# EAGLE design tclab_v_2 (EAGLE 7.2.0)
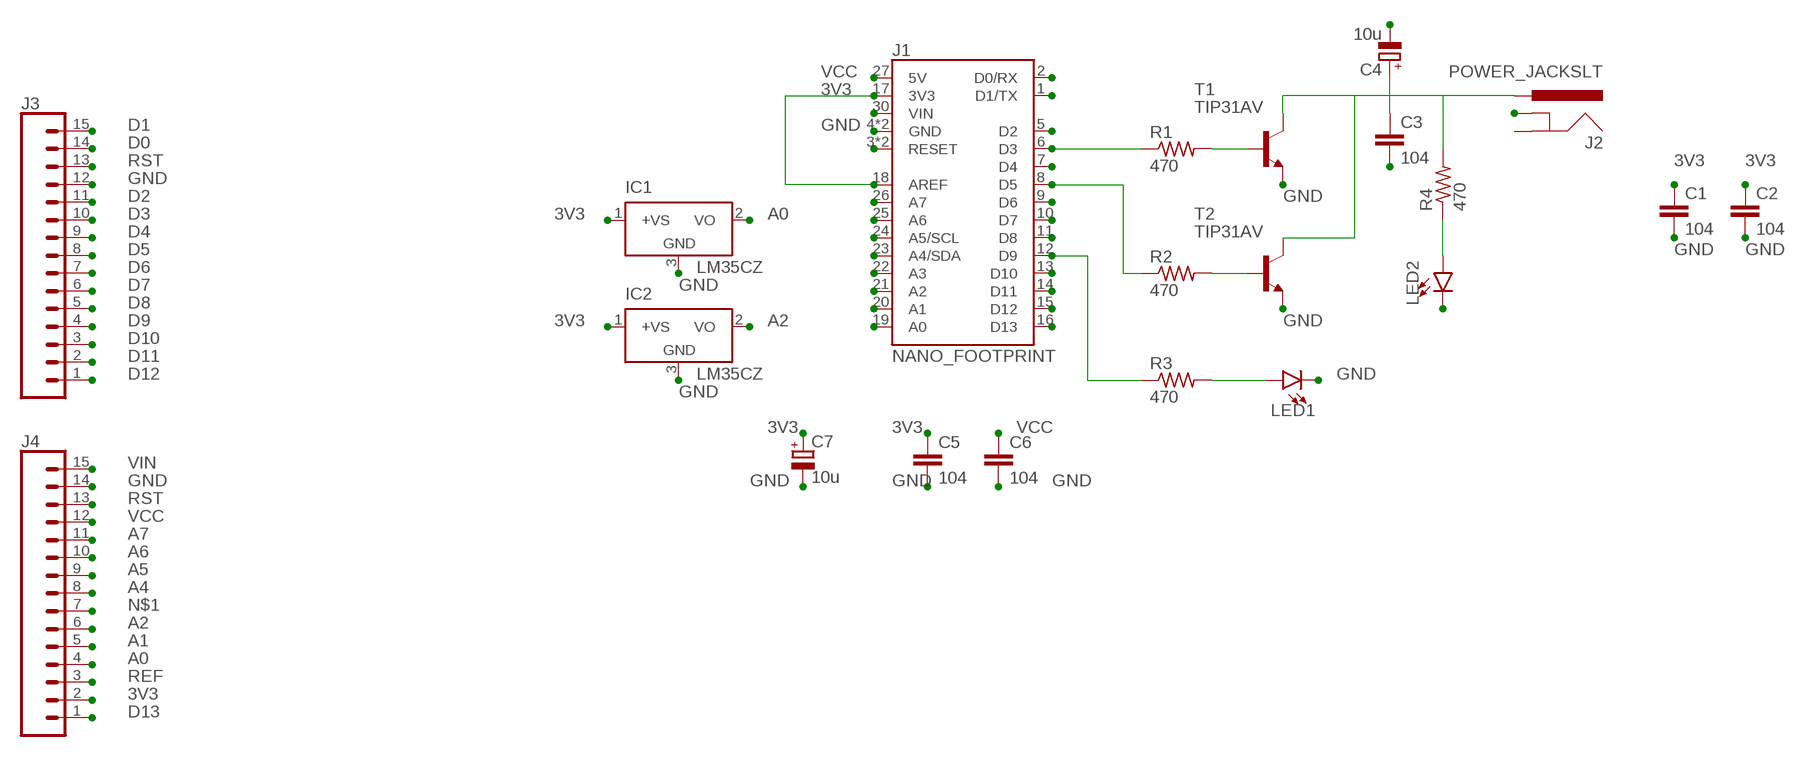
[diagram p0: schematic, sheet 1]

## Parts
C1  104  C-EU025-025X050  [C025-025X050]
C2  104  C-EU025-025X050  [C025-025X050]
C3  104  C-EU025-025X050  [C025-025X050]
C4  10u  CPOL-EUE2.5-7  [E2,5-7]
C5  104  C-EU025-025X050  [C025-025X050]
C6  104  C-EU025-025X050  [C025-025X050]
C7  10u  CPOL-EUE2.5-7  [E2,5-7]
IC1  LM35CZ  [TO92]
IC2  LM35CZ  [TO92]
J1  NANO_FOOTPRINT  [NANO]
J2  POWER_JACKSLT  [POWER_JACK_SLOT]
J3  CONN_15  [1X15]
J4  CONN_15  [1X15]
LED1  LED5MM  [LED_5MM]
LED2  LED5MM  [LED_5MM]
R1  470  R-US_0204/7  [0204/7]
R2  470  R-US_0204/7  [0204/7]
R3  470  R-US_0204/7  [0204/7]
R4  470  R-US_0204/7  [0204/7]
T1  TIP31AV  [TO220AV]
T2  TIP31AV  [TO220AV]

## Nets
3V3: C1.1 C2.1 C5.1 C7.+ IC1.1(+VS) IC2.1(+VS) J1.17(3V3) J1.18(AREF) J4.2
A0: IC1.2(VO) J1.19(A0) J4.4
A1: J1.20(A1) J4.5
A2: IC2.2(VO) J1.21(A2) J4.6
A4: J1.23(A4/SDA) J4.8
A5: J1.24(A5/SCL) J4.9
A6: J1.25(A6) J4.10
A7: J1.26(A7) J4.11
D0: J1.2(D0/RX) J3.14
D1: J1.1(D1/TX) J3.15
D2: J1.5(D2) J3.11
D3: J1.6(D3) J3.10 R1.1
D4: J1.7(D4) J3.9
D5: J1.8(D5) J3.8 R2.1
D6: J1.9(D6) J3.7
D7: J1.10(D7) J3.6
D8: J1.11(D8) J3.5
D9: J1.12(D9) J3.4 R3.1
D10: J1.13(D10) J3.3
D11: J1.14(D11) J3.2
D12: J1.15(D12) J3.1
D13: J1.16(D13) J4.1
GND: C1.2 C2.2 C3.2 C4.- C5.2 C6.2 C7.- IC1.3(GND) IC2.3(GND) J1.4(GND) J1.29(GND) J2.GND@1(GNDBREAK) J3.12 J4.14 LED1.K(C) LED2.K(C) T1.3(E) T2.3(E)
N$1: J1.22(A3) J4.7
N$4: LED1.A R3.2
N$6: R2.2 T2.1(B)
N$8: R1.2 T1.1(B)
N$9: C3.1 C4.+ J2.PWR R4.2 T1.2(C) T2.2(C)
N$10: LED2.A R4.1
REF: J4.3
RST: J1.3(RESET) J1.28(RESET) J3.13 J4.13
VCC: C6.1 J1.27(5V) J4.12
VIN: J1.30(VIN) J4.15
Unconnected: J2.GND@2(GND)

## Library data of the parts
C1-C3 C5 C6 = resistor:C-EU: CAPACITOR, European symbol
C4 C7 = rcl:CPOL-EU: POLARIZED CAPACITOR, European symbol
IC1 IC2 = lm35:LM35: Single-Supply Centigrade Temperature Sensor Vout = (10mV/°C x Temp °C) +5mmmV Source: http://www.national.com/ds/LM/LM35.pdf
J1 = SparkFun-Boards:NANO_FOOTPRINT: Generic Nano Footprint
J2 = SparkFun-Connectors:POWER_JACK: Power Jack Connector This is the standard 5.5mm barrel jack for power. The PTH is the most common, proven, reliable, footprint. The Slot footprint only works if the mill layer is transmitted to the PCB fab house so be warned. Here are the connectors we sell at SparkFun: DC Barrel Power Jack/Connector <https://www.sparkfun.com/products/119> (PRT-00119) DC Barrel Power Jack/Connector (SMD) <https://www.sparkfun.com/products/12748> (PRT-12748) DC Barrel Jack Adapter - Breadboard Compatible <https://www.sparkfun.com/products/10811> (PRT-10811) It is used on this SparkFun product (and many, many others): SparkFun RedBoard - Programmed with Arduino <https://www.sparkfun.com/products/12757> (DEV-12757) Also, if you need a mating power supply or connector, please check these out: Wall Adapter Power Supply - 9VDC 650mA <https://www.sparkfun.com/products/298> (TOL-00298) DC Barrel Jack Adapter - Male <https://www.sparkfun.com/products/10287> (PRT-10287); PROD_ID: PRT-00119
J3 J4 = SparkFun-Connectors:CONN_15: Multi connection point. Often used as Generic Header-pin footprint for 0.1 inch spaced/style header connections On any of the 0.1 inch spaced packages, you can populate with these: Break Away Headers - Straight <https://www.sparkfun.com/products/116> (PRT-00116) Break Away Male Headers - Right Angle <https://www.sparkfun.com/products/553> (PRT-00553) Female Headers <https://www.sparkfun.com/products/115> (PRT-00115) Break Away Headers - Machine Pin <https://www.sparkfun.com/products/117> (PRT-00117) Break Away Female Headers - Swiss Machine Pin <https://www.sparkfun.com/products/743> (PRT-00743) For SCREWTERMINALS and SPRING TERMINALS visit here: Screw Terimnals on SparkFun.com <https://www.sparkfun.com/search/results?term=Screw+Terminals> (5mm/3.5mm/2.54mm spacing) This device is also useful as a general connection point to wire up your design to another part of your project. Our various solder wires solder well into these plated through hole pads. Hook-Up Wire - Assortment (Stranded, 22 AWG) <https://www.sparkfun.com/products/11375> (PRT-11375) Hook-Up Wire - Assortment (Solid Core, 22 AWG) <https://www.sparkfun.com/products/11367> (PRT-11367) View the entire wire category on our website here <https://www.sparkfun.com/categories/141> Special notes: Molex polarized connector foot print use with SKU : PRT-08231 with associated crimp pins and housings. 1MM SMD Version SKU: PRT-10208 NOTES ON THE VARIANTS LOCK and LOCK_LONGPADS... This footprint was designed to help hold the alignment of a through-hole component (i.e. 6-pin header) while soldering it into place. You may notice that each hole has been shifted either up or down by 0.005 of an inch from it's more standard position (which is a perfectly straight line). This slight alteration caused the pins (the squares in the middle) to touch the edges of the holes. Because they are alternating, it causes a "brace" to hold the component in place. 0.005 has proven to be the perfect amount of "off-center" position when using our standard breakaway headers. Although looks a little odd when you look at the bare footprint, once you have a header in there, the alteration is very hard to notice. Also,if you push a header all the way into place, it is covered up entirely on the bottom side.
LED1 LED2 = SparkFun-LED:LED: LED (Generic) Standard schematic elements and footprints for 5mm, 3mm, 1206, and 0603 sized LEDs. Generic LEDs with no color specified.
R1-R4 = resistor:R-US_: RESISTOR, American symbol
T1 T2 = transistor:TIP31: NPN Transistor Medium Power Linear Switching Applications Source: http://onsemi.com

## Board
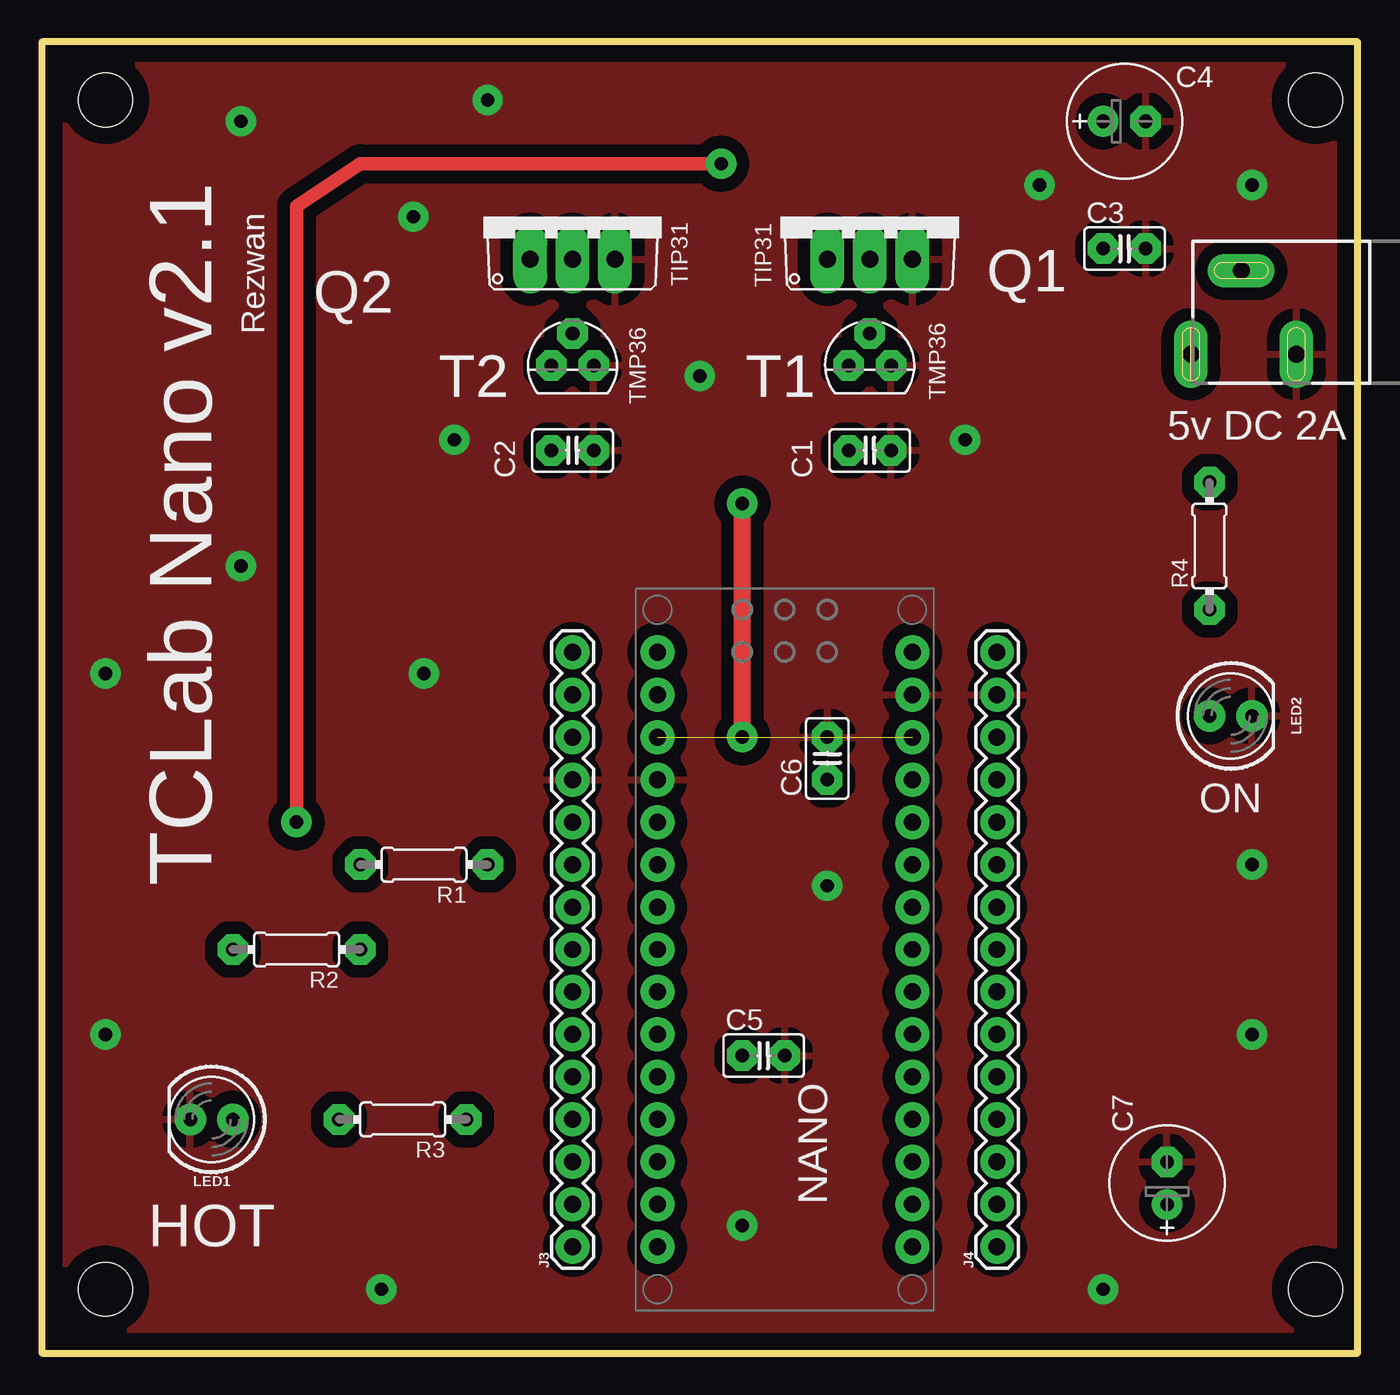
[diagram p1: board, top side]
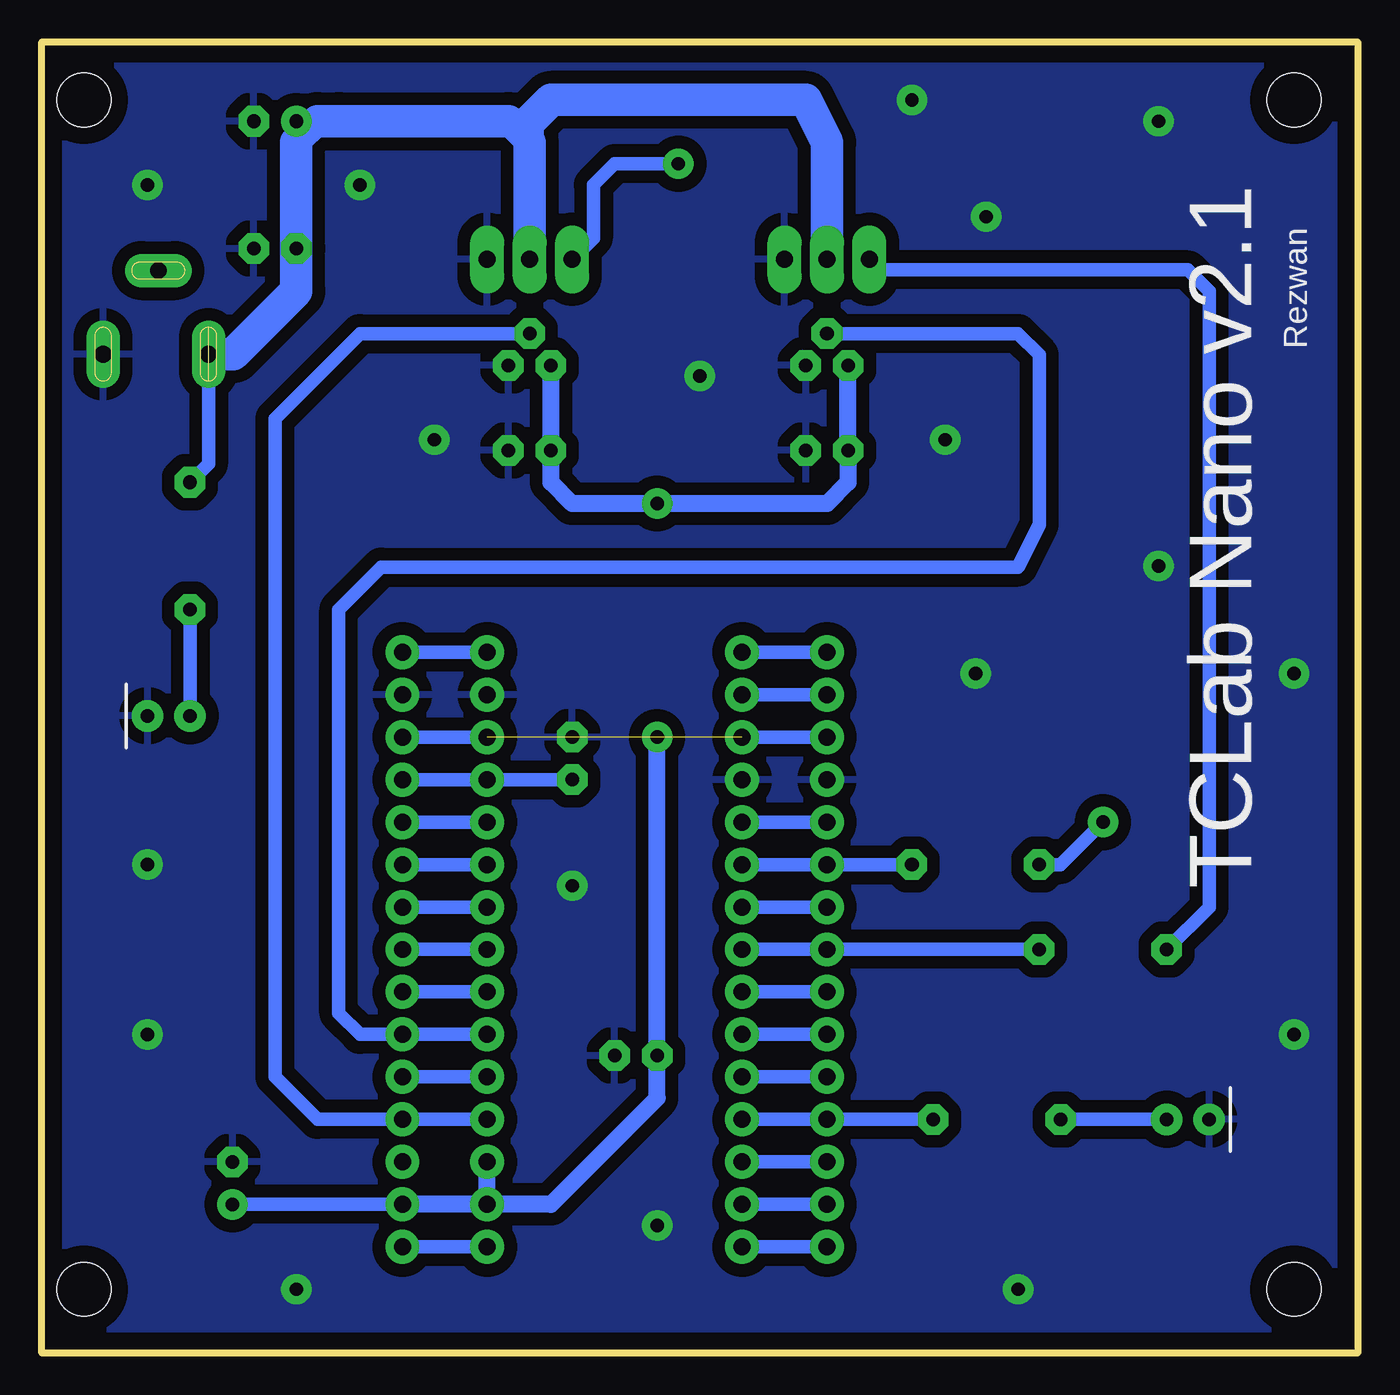
[diagram p2: board, bottom side, seen from below]

Size 78.72 x 78.41 mm. Coordinates in mm from the lower left corner, seen from the top.
Outline: 0,0 78.72,0 78.72,78.41 0,78.41 0,0
Copper layers (1*16): Top 0.035mm / dielectric 1.5mm / Bottom 0.035mm
Design rules "techshop": minimum track width 30mil, minimum drill 30mil, track to track 30mil, track to pad 30mil, pad to pad 20mil, via to via 30mil, smd to smd 8mil, copper to edge 40mil, drill to drill 30mil, minimum pad ring 20mil, minimum via ring 20mil, stop-mask expansion 4mil, vias tented up to drill 0mil, thermal gap 30mil
Holes 3.2 mm at 3.81,3.81 76.2,3.81 3.81,74.93 76.2,74.93

### Footprints (pad centres in the part's own frame; a part is rotated, then mirrored left to right if it is on the bottom)
C025-025X050 = drill 0.813 octagon: 1 -1.27,0; 2 1.27,0
E2,5-7 = drill 0.813 pad 1.6: + -1.27,0 | drill 0.813 pad 1.6 octagon: - 1.27,0
TO92 = drill 0.813 octagon: 1 -1.27,0; 2 0,1.905; 3 1.27,0
NANO = drill 1.016: 1 -7.62,17.78; 2 -7.62,15.24; 3 -7.62,12.7; 4 -7.62,10.16; 5 -7.62,7.62; 6 -7.62,5.08; 7 -7.62,2.54; 8 -7.62,0; 9 -7.62,-2.54; 10 -7.62,-5.08; 11 -7.62,-7.62; 12 -7.62,-10.16; 13 -7.62,-12.7; 14 -7.62,-15.24; 15 -7.62,-17.78; 16 7.62,-17.78; 17 7.62,-15.24; 18 7.62,-12.7; 19 7.62,-10.16; 20 7.62,-7.62; 21 7.62,-5.08; 22 7.62,-2.54; 23 7.62,0; 24 7.62,2.54; 25 7.62,5.08; 26 7.62,7.62; 27 7.62,10.16; 28 7.62,12.7; 29 7.62,15.24; 30 7.62,17.78
POWER_JACK_SLOT = drill 1 pad 2 long: GND@1 2.58,7.5; GND@2 7.58,10.8; PWR 2.58,13.8
1X15 = drill 1.016 pad 1.88: 1 0,0; 2 2.54,0; 3 5.08,0; 4 7.62,0; 5 10.16,0; 6 12.7,0; 7 15.24,0; 8 17.78,0; 9 20.32,0; 10 22.86,0; 11 25.4,0; 12 27.94,0; 13 30.48,0; 14 33.02,0; 15 35.56,0
LED_5MM = drill 0.813 pad 1.88: A -1.27,0; K 1.27,0
0204/7 = drill 0.813 octagon: 1 -3.81,0; 2 3.81,0
TO220AV = drill 1.016 long: 1 -2.54,-2.54; 2 0,-2.54; 3 2.54,-2.54

### Placement (x,y rotation side)
C1  49.53,53.98 0 top
C2  31.75,53.98 0 top
C3  64.77,66.04 0 top
C4  64.77,73.66 0 top
C5  43.18,17.78 0 top
C6  46.99,35.56 90 top
C7  67.31,10.16 90 top
IC1  49.53,59.05 0 top
IC2  31.75,59.05 0 top
J1  44.45,24.13 0 top
J2  82.55,57.15 90 top
J3  31.75,6.35 90 top
J4  57.15,6.35 90 top
LED1  10.16,13.97 180 top
LED2  71.12,38.1 0 top
R1  22.86,29.21 180 top
R2  15.24,24.13 180 top
R3  21.59,13.97 180 top
R4  69.85,48.26 90 top
T1  49.53,67.94 0 top
T2  31.75,67.94 0 top

### Tracks (layer width: path | path; a pad name or v marks a point on that pad's centre or on a via)
3V3  (via drill 0.8)
  Top 1.016: v41.91,36.83 v41.91,50.8
  Bottom 0.813: J4.2 C7.+
  Bottom 1.016: v41.91,36.83 C5.1 41.91,15.24 48.26,8.89 J1.17 | IC1.1 C1.1 48.26,52.07 46.99,50.8 v41.91,50.8 31.75,50.8 30.48,52.07 C2.1 IC2.1 | J1.17 J4.2 | J1.17 J1.18
A0
  Bottom 0.813: IC1.2 59.69,60.96 64.77,55.88 64.77,16.51 62.23,13.97 J4.4 J1.19
A1
  Bottom 0.813: J1.20 J4.5
A2
  Bottom 0.813: IC2.2 20.32,60.96 19.05,59.69 19.05,49.53 20.32,46.99 58.42,46.99 60.96,44.45 60.96,20.32 59.69,19.05 J4.6 J1.21
A4
  Bottom 0.813: J1.23 J4.8
A5
  Bottom 0.813: J1.24 J4.9
A6
  Bottom 0.813: J1.25 J4.10
A7
  Bottom 0.813: J1.26 J4.11
D0
  Bottom 0.813: J3.14 J1.2
D1
  Bottom 0.813: J3.15 J1.1
D2
  Bottom 0.813: J3.11 J1.5
D3
  Bottom 0.813: R1.1 J3.10 J1.6
D4
  Bottom 0.813: J3.9 J1.7
D5
  Bottom 0.813: R2.1 J3.8 J1.8
D6
  Bottom 0.813: J3.7 J1.9
D7
  Bottom 0.813: J3.6 J1.10
D8
  Bottom 0.813: J3.5 J1.11
D9
  Bottom 0.813: R3.1 J3.4 J1.12
D10
  Bottom 0.813: J3.3 J1.13
D11
  Bottom 0.813: J3.2 J1.14
D12
  Bottom 0.813: J3.1 J1.15
D13
  Bottom 0.813: J1.16 J4.1
GND  (via drill 0.8)
  other vias: 26.67,74.93 3.81,40.64 20.32,3.81 11.9,47.06 22.86,40.64 24.67,54.61 63.5,3.81 72.39,19.05 72.39,29.21 59.69,69.85 72.39,69.85 39.37,58.42 22.23,67.94 11.9,73.66 41.91,7.62 55.24,54.61 46.99,27.94 3.81,19.05
  pour Bottom: 0,0 78.74,0 78.74,78.74 0,78.74
  pour Top: 0,0 78.74,0 78.74,78.74 0,78.74
N$1
  Bottom 0.813: J1.22 J4.7
N$4
  Bottom 0.813: R3.2 LED1.A
N$6
  Bottom 0.813: R2.2 8.89,26.67 8.89,63.5 10.16,64.77 28.57,64.77 T2.1
N$8  (via drill 0.8, 0.8 pad 0.81)
  Top 0.813: v40.64,71.12 19.05,71.12 15.24,68.58 v15.24,31.75
  Bottom 0.813: R1.2 17.78,29.21 v15.24,31.75 | v40.64,71.12 44.45,71.12 45.72,69.85 45.72,66.67 T1.1
N$9
  Bottom 0.813: J2.PWR 68.75,53.17 R4.2
  Bottom 1.016: C3.1 C4.+
  Bottom 1.27: C4.+ 60.96,73.66
  Bottom 1.676: 63.5,72.39 62.23,73.66 | 50.8,73.66 49.53,72.39 49.53,73.66
  Bottom 1.93: J2.PWR 67.27,59.73 63.5,63.5 C3.1 63.5,72.39 | 62.23,73.66 60.96,73.66 50.8,73.66 | 49.53,72.39 T1.2 | T2.2 31.75,72.39 33.02,74.93 48.26,74.93 49.53,73.66
N$10
  Bottom 0.813: R4.1 LED2.A
RST  (1 unrouted)
  Bottom 0.813: J3.13 J1.3 | J1.28 J4.13
VCC
  Bottom 0.813: J4.12 J1.27 C6.1
VIN
  Bottom 0.813: J1.30 J4.15

### Text on the board
tPlace: TIP31 | TIP31 | TMP36 | TMP36
tNames: Q1 | Q2 | Rezwan | T2 | T1 | 5v DC 2A | ON | TCLab Nano v2.1 | HOT | NANO
bNames: TCLab Nano v2.1 | Rezwan